# EAGLE design Edin_TinyPico_Nano (EAGLE 9.6.2)
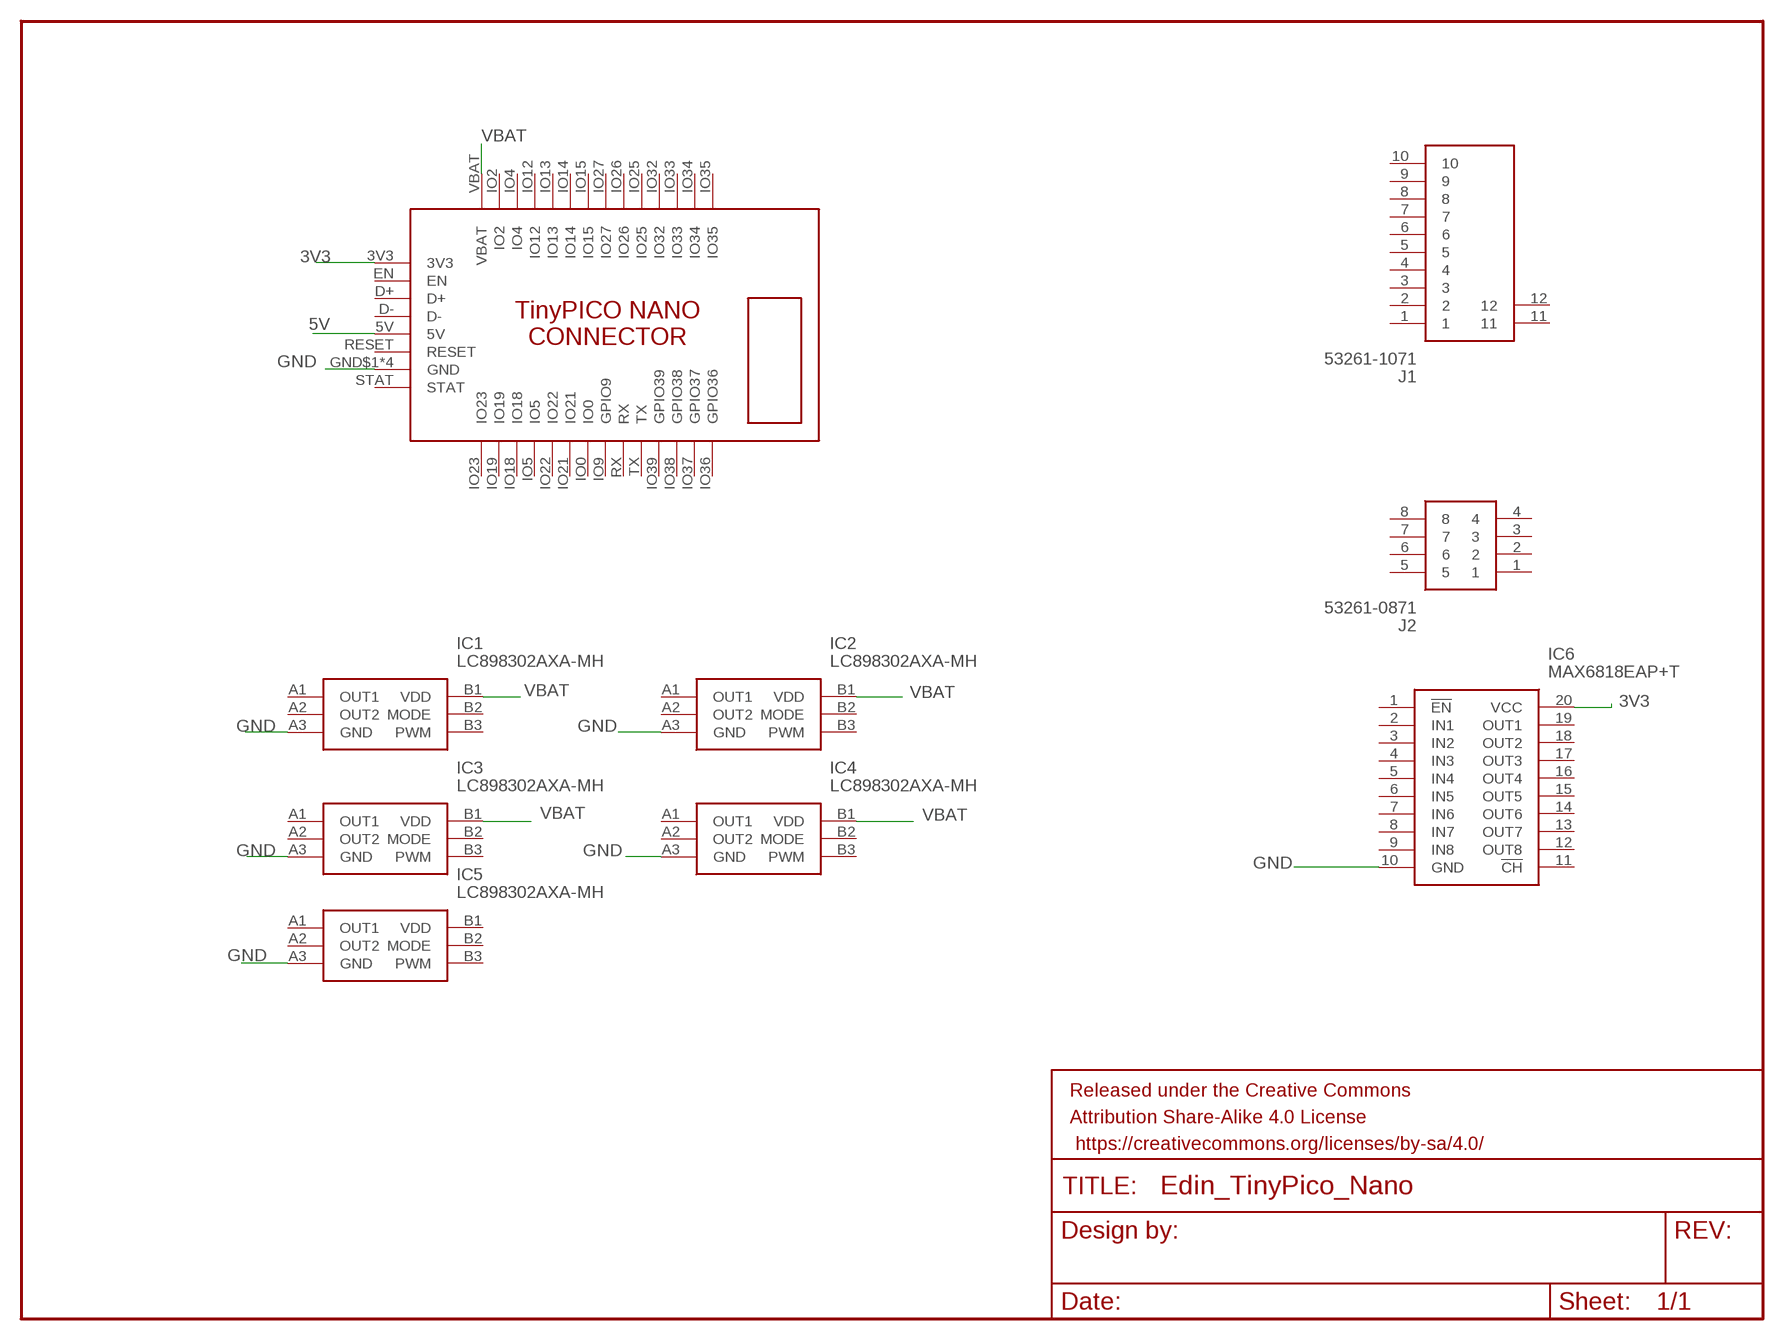
[diagram p0: schematic, sheet 1]

## Parts
FRAME1  FRAME-LETTER  [CREATIVE_COMMONS]
IC1  LC898302AXA-MH  [BGA6C40P3X2_118X78X65]
IC2  LC898302AXA-MH  [BGA6C40P3X2_118X78X65]
IC3  LC898302AXA-MH  [BGA6C40P3X2_118X78X65]
IC4  LC898302AXA-MH  [BGA6C40P3X2_118X78X65]
IC5  LC898302AXA-MH  [BGA6C40P3X2_118X78X65]
IC6  MAX6818EAP+T  [SOP65P778X199-20N]
J1  53261-1071  [532611071]
J2  53261-0871  [53261-0871]
U$1  TINYPICO-NANO-CONNECTOR  [TINYPICO-NANO-CONNECTOR]

## Nets
3V3: IC6.20(VCC) U$1.3V3
5V: U$1.5V
GND: IC1.A3(GND) IC2.A3(GND) IC3.A3(GND) IC4.A3(GND) IC5.A3(GND) IC6.10(GND) U$1.GND$1(GND) U$1.GND$2(GND) U$1.GND$3(GND) U$1.GND$4(GND)
VBAT: IC1.B1(VDD) IC2.B1(VDD) IC3.B1(VDD) IC4.B1(VDD) U$1.VBAT
Unconnected: IC1.A1(OUT1) IC1.A2(OUT2) IC1.B2(MODE) IC1.B3(PWM) IC2.A1(OUT1) IC2.A2(OUT2) IC2.B2(MODE) IC2.B3(PWM) IC3.A1(OUT1) IC3.A2(OUT2) IC3.B2(MODE) IC3.B3(PWM) IC4.A1(OUT1) IC4.A2(OUT2) IC4.B2(MODE) IC4.B3(PWM) IC5.A1(OUT1) IC5.A2(OUT2) IC5.B1(VDD) IC5.B2(MODE) IC5.B3(PWM) IC6.1(!EN) IC6.2(IN1) IC6.3(IN2) IC6.4(IN3) IC6.5(IN4) IC6.6(IN5) IC6.7(IN6) IC6.8(IN7) IC6.9(IN8) IC6.11(!CH) IC6.12(OUT8) IC6.13(OUT7) IC6.14(OUT6) IC6.15(OUT5) IC6.16(OUT4) IC6.17(OUT3) IC6.18(OUT2) IC6.19(OUT1) J1.1 J1.2 J1.3 J1.4 J1.5 J1.6 J1.7 J1.8 J1.9 J1.10 J1.11 J1.12 J2.1 J2.2 J2.3 J2.4 J2.5 J2.6 J2.7 J2.8 U$1.D+ U$1.D- U$1.EN U$1.IO0 U$1.IO2 U$1.IO4 U$1.IO5 U$1.IO9(GPIO9) U$1.IO12 U$1.IO13 U$1.IO14 U$1.IO15 U$1.IO18 U$1.IO19 U$1.IO21 U$1.IO22 U$1.IO23 U$1.IO25 U$1.IO26 U$1.IO27 U$1.IO32 U$1.IO33 U$1.IO34 U$1.IO35 U$1.IO36(GPIO36) U$1.IO37(GPIO37) U$1.IO38(GPIO38) U$1.IO39(GPIO39) U$1.RESET U$1.RX U$1.STAT U$1.TX

## Library data of the parts
FRAME1 = SparkFun-Aesthetics:FRAME-LETTER: Schematic Frame - Letter Standard 8.5x11 US Letter frame
IC1-IC5 = SamacSys_Parts:LC898302AXA-MH: Motor / Motion / Ignition Controllers & Drivers Linear Vibrator Driv Source: Datasheet <https://www.arrow.com/en/products/lc898302axa-mh/on-semiconductor>; DESCRIPTION: Motor / Motion / Ignition Controllers & Drivers Linear Vibrator Driv; HEIGHT: 0.65mm; MANUFACTURER_NAME: ON Semiconductor; MANUFACTURER_PART_NUMBER: LC898302AXA-MH; MOUSER_PART_NUMBER: 863-LC898302AXA-MH; MOUSER_PRICE-STOCK: https://www.mouser.co.uk/ProductDetail/ON-Semiconductor/LC898302AXA-MH?qs=raqtESnDWsCbGq19hBfPlw%3D%3D
IC6 = SamacSys_Parts:MAX6818EAP+T: MAXIM INTEGRATED PRODUCTS - MAX6818EAP+T. - ESD PROTE WITH SWITCH DEBOUNCER, SSOP-20 Source: Datasheet; DESCRIPTION: MAXIM INTEGRATED PRODUCTS - MAX6818EAP+T. - ESD PROTE WITH SWITCH DEBOUNCER, SSOP-20; HEIGHT: 1.99mm; MANUFACTURER_NAME: Maxim Integrated; MANUFACTURER_PART_NUMBER: MAX6818EAP+T; MOUSER_PART_NUMBER: 700-MAX6818EAPT; MOUSER_PRICE-STOCK: https://www.mouser.co.uk/ProductDetail/Maxim-Integrated/MAX6818EAP%2bT?qs=CDqwynd4ZNoKt6d34O8j%252BA%3D%3D
J1 = SamacSys_Parts:53261-1071: 10 way SMT r/a header Molex PICOBLADE Series, Series Number 53261, 1.25mm Pitch 10 Way 1 Row Shrouded Right Angle PCB Header, Surface Mount Source: Datasheet <https://www.molex.com/webdocs/datasheets/pdf/en-us/0532611071_PCB_HEADERS.pdf>; DESCRIPTION: 10 way SMT r/a header Molex PICOBLADE Series, Series Number 53261, 1.25mm Pitch 10 Way 1 Row Shrouded Right Angle PCB Header, Surface Mount; HEIGHT: 3mm; MANUFACTURER_NAME: Molex; MANUFACTURER_PART_NUMBER: 53261-1071; MOUSER_PART_NUMBER: 538-53261-1071; MOUSER_PRICE-STOCK: https://www.mouser.co.uk/ProductDetail/Molex/53261-1071?qs=%252B72YyncTwW%252Bzs3RwZTiukQ%3D%3D
J2 = SamacSys_Parts:53261-0871: Molex PICOBLADE Series, Series Number 53261, 1.25mm Pitch, 8 Way 1 Row Shrouded Right Angle PCB Header, Surface Mount Source: Datasheet <http://www.molex.com/webdocs/datasheets/pdf/en-us/0532610871_PCB_HEADERS.pdf>; DESCRIPTION: Molex PICOBLADE Series, Series Number 53261, 1.25mm Pitch, 8 Way 1 Row Shrouded Right Angle PCB Header, Surface Mount; HEIGHT: mm; MANUFACTURER_NAME: Molex; MANUFACTURER_PART_NUMBER: 53261-0871; MOUSER_PART_NUMBER: 538-53261-0871; MOUSER_PRICE-STOCK: https://www.mouser.co.uk/ProductDetail/Molex/53261-0871?qs=%252B72YyncTwW%252BggfdCJ7Netw%3D%3D
U$1 = TinyPICO_NANO_Eagle:TINYPICO-NANO-CONNECTOR: TinyPICO NANO Footprint https://www.tinypico.com/tinypico-nano

## Board
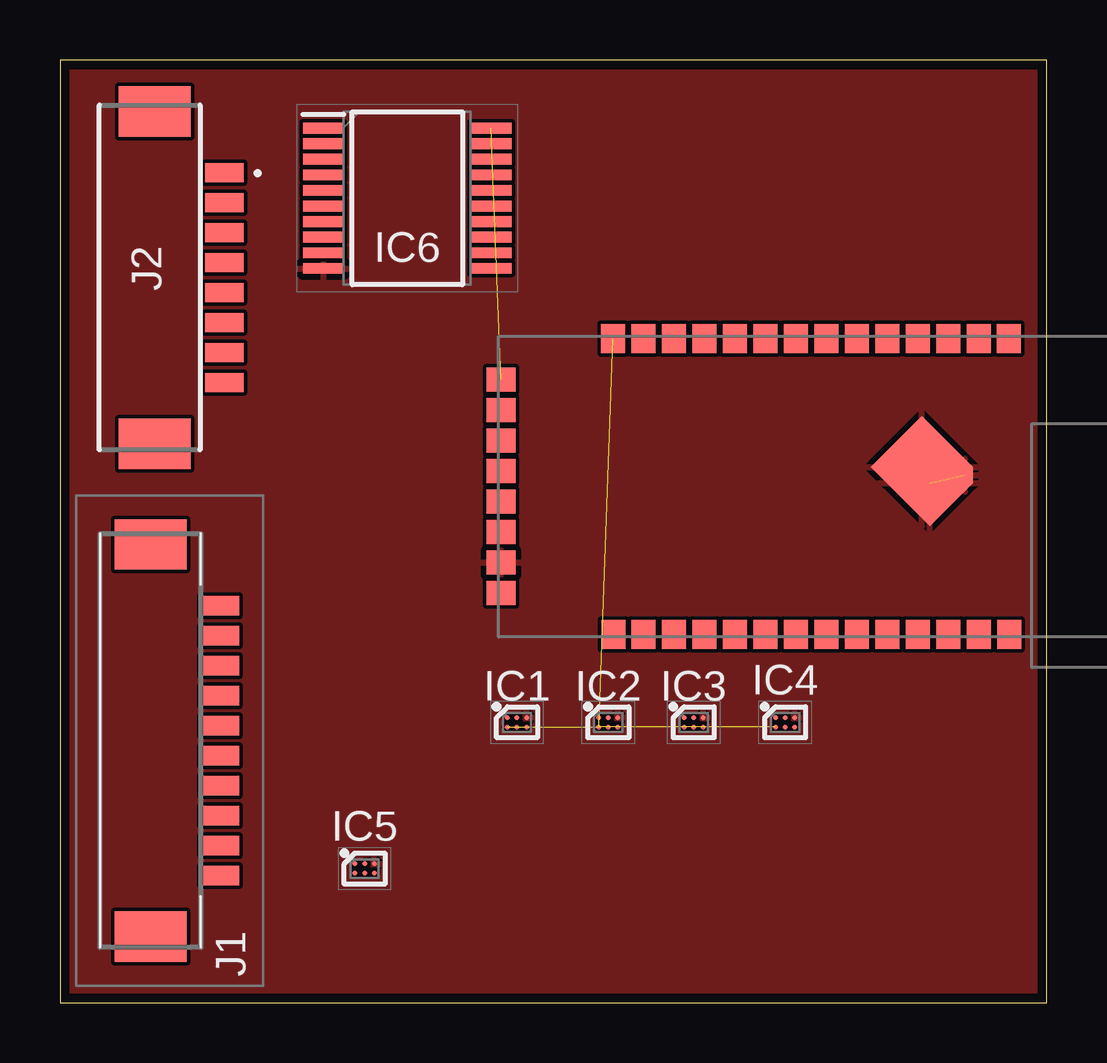
[diagram p1: board, top side]
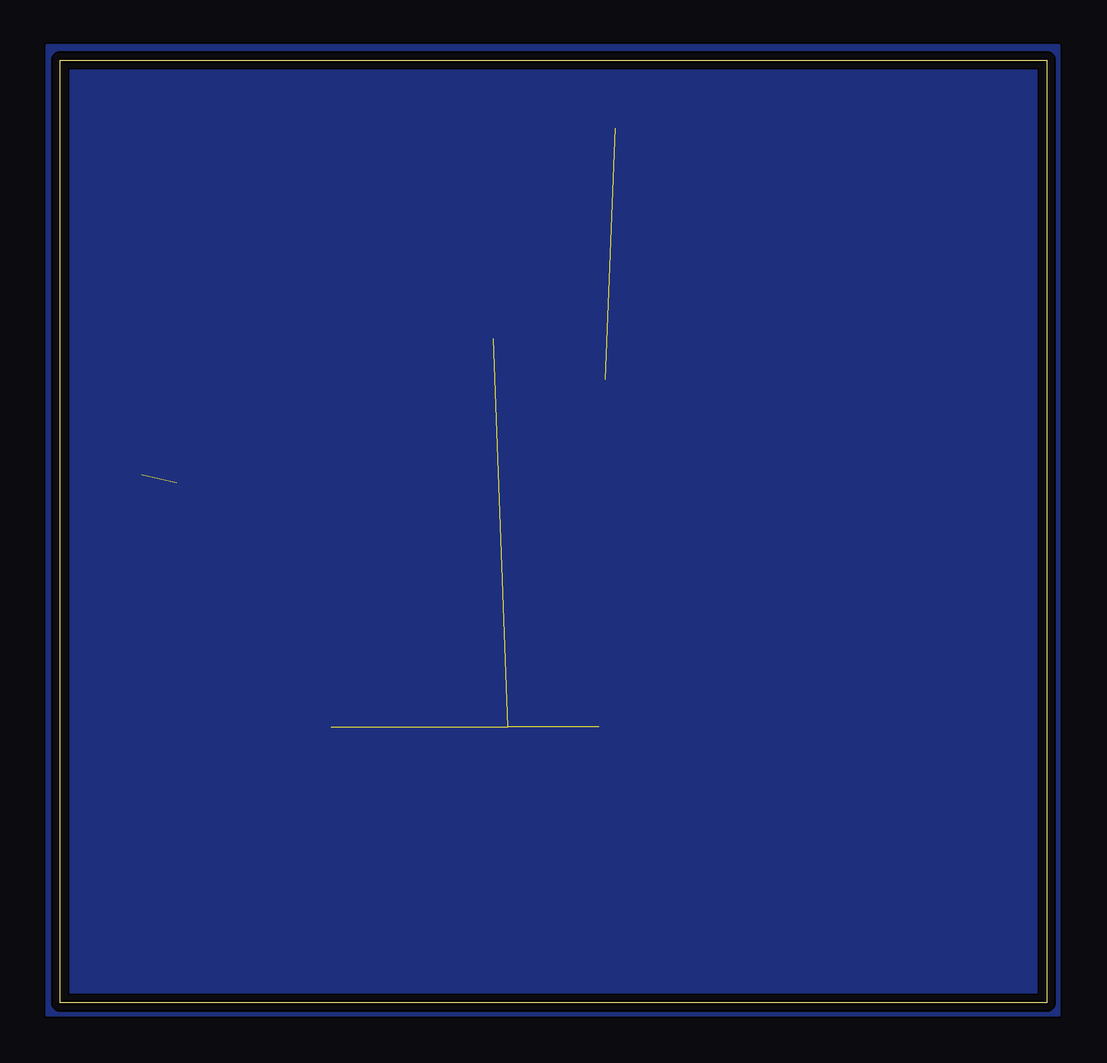
[diagram p2: board, bottom side, seen from below]

Size 41.13 x 39.29 mm. Coordinates in mm from the lower left corner, seen from the top.
Outline: 0,0 41.13,0 41.13,39.29 0,39.29 0,0
Copper layers (1*16): Top 0.035559375mm / dielectric 1.6mm / Bottom 0.035559375mm
Design rules "oshpark-2layer": minimum track width 6mil, minimum drill 10mil, track to track 6mil, track to pad 6mil, pad to pad 6mil, via to via 6mil, smd to smd 6mil, copper to edge 15mil, drill to drill 6mil, minimum pad ring 5mil, minimum via ring 5mil, stop-mask expansion 2.5mil, vias tented up to drill 0mil, thermal gap 10mil

### Footprints (pad centres in the part's own frame; a part is rotated, then mirrored left to right if it is on the bottom)
BGA6C40P3X2_118X78X65 = smd 0.2 x 0.2: A1 -0.4,0.2; A2 0,0.2; A3 0.4,0.2; B1 -0.4,-0.2; B2 0,-0.2; B3 0.4,-0.2
SOP65P778X199-20N = smd 1.705 x 0.45: 1 -3.498,2.925; 2 -3.498,2.275; 3 -3.498,1.625; 4 -3.498,0.975; 5 -3.498,0.325; 6 -3.498,-0.325; 7 -3.498,-0.975; 8 -3.498,-1.625; 9 -3.498,-2.275; 10 -3.498,-2.925; 11 3.498,-2.925; 12 3.498,-2.275; 13 3.498,-1.625; 14 3.498,-0.975; 15 3.498,-0.325; 16 3.498,0.325; 17 3.498,0.975; 18 3.498,1.625; 19 3.498,2.275; 20 3.498,2.925
532611071 = smd 0.8 x 1.6: 1 -5.625,2.1; 2 -4.375,2.1; 3 -3.125,2.1; 4 -1.875,2.1; 5 -0.625,2.1; 6 0.625,2.1; 7 1.875,2.1; 8 3.125,2.1; 9 4.375,2.1; 10 5.625,2.1 | smd 2.1 x 3: 11 -8.175,-0.8; 12 8.175,-0.8
53261-0871 = smd 0.8 x 1.6: 1 -4.375,1.004; 2 -3.125,1.004; 3 -1.875,1.004; 4 -0.625,1.004; 5 0.625,1.004; 6 1.875,1.004; 7 3.125,1.004; 8 4.375,1.004 | smd 2.1 x 3: 9 6.925,-1.896; 10 -6.925,-1.896
TINYPICO-NANO-CONNECTOR = smd 1.2 x 1: 3V3 0.1,10.725; 5V 0.1,5.645; D+ 0.1,8.185; D- 0.1,6.915; EN 0.1,9.455; GND$1 0.1,3.105; RESET 0.1,4.375; STAT 0.1,1.835 | smd 3 x 3 rotated 45: GND$2 17.643,7.082 | smd 0.66 x 0.671: GND$3 19.436,6.746 | smd 2.54 x 2.54 rotated 45: GND$4 17.971,6.413 | smd 1 x 1.2: IO0 12.395,0.1; IO2 6.034,12.44; IO4 7.304,12.44; IO5 8.585,0.1; IO9 13.665,0.1; IO12 8.574,12.44; IO13 9.844,12.44; IO14 11.114,12.44; IO15 12.384,12.44; IO18 7.315,0.1; IO19 6.045,0.1; IO21 11.125,0.1; IO22 9.855,0.1; IO23 4.775,0.1; IO25 16.194,12.44; IO26 14.924,12.44; IO27 13.654,12.44; IO32 17.464,12.44; IO33 18.734,12.44; IO34 20.004,12.44; IO35 21.274,12.44; IO36 21.285,0.1; IO37 20.015,0.1; IO38 18.745,0.1; IO39 17.475,0.1; RX 14.935,0.1; TX 16.205,0.1; VBAT 4.764,12.44

### Placement (x,y rotation side)
FRAME1  24.13,68.58 0 top  (outside the outline)
IC1  19.05,11.68 0 top
IC2  22.86,11.68 0 top
IC3  26.42,11.68 0 top
IC4  30.23,11.68 0 top
IC5  12.7,5.59 0 top
IC6  14.48,33.53 0 top
J1  4.57,10.92 270 top
J2  5.84,30.23 270 top
U$1  18.29,15.24 0 top

### Tracks (layer width: path | path; a pad name or v marks a point on that pad's centre or on a via)
3V3  (1 unrouted)
GND  (1 unrouted)
  pour Top: -0.51,39.62 -0.51,-0.76 41.66,-0.76 41.66,39.62
  pour Bottom: -0.51,39.88 -0.51,-0.51 41.66,-0.51 41.66,39.88
VBAT  (4 unrouted)